# Altium schematic sheet GPS.SchDoc: GPS Module
size A; Date: 2025/09/10; Author: Ruo Chen; DrawnBy: Ruo Chen; Engineer: Ruo Chen; Revision: A; SheetNumber: 1; SheetTotal: 1
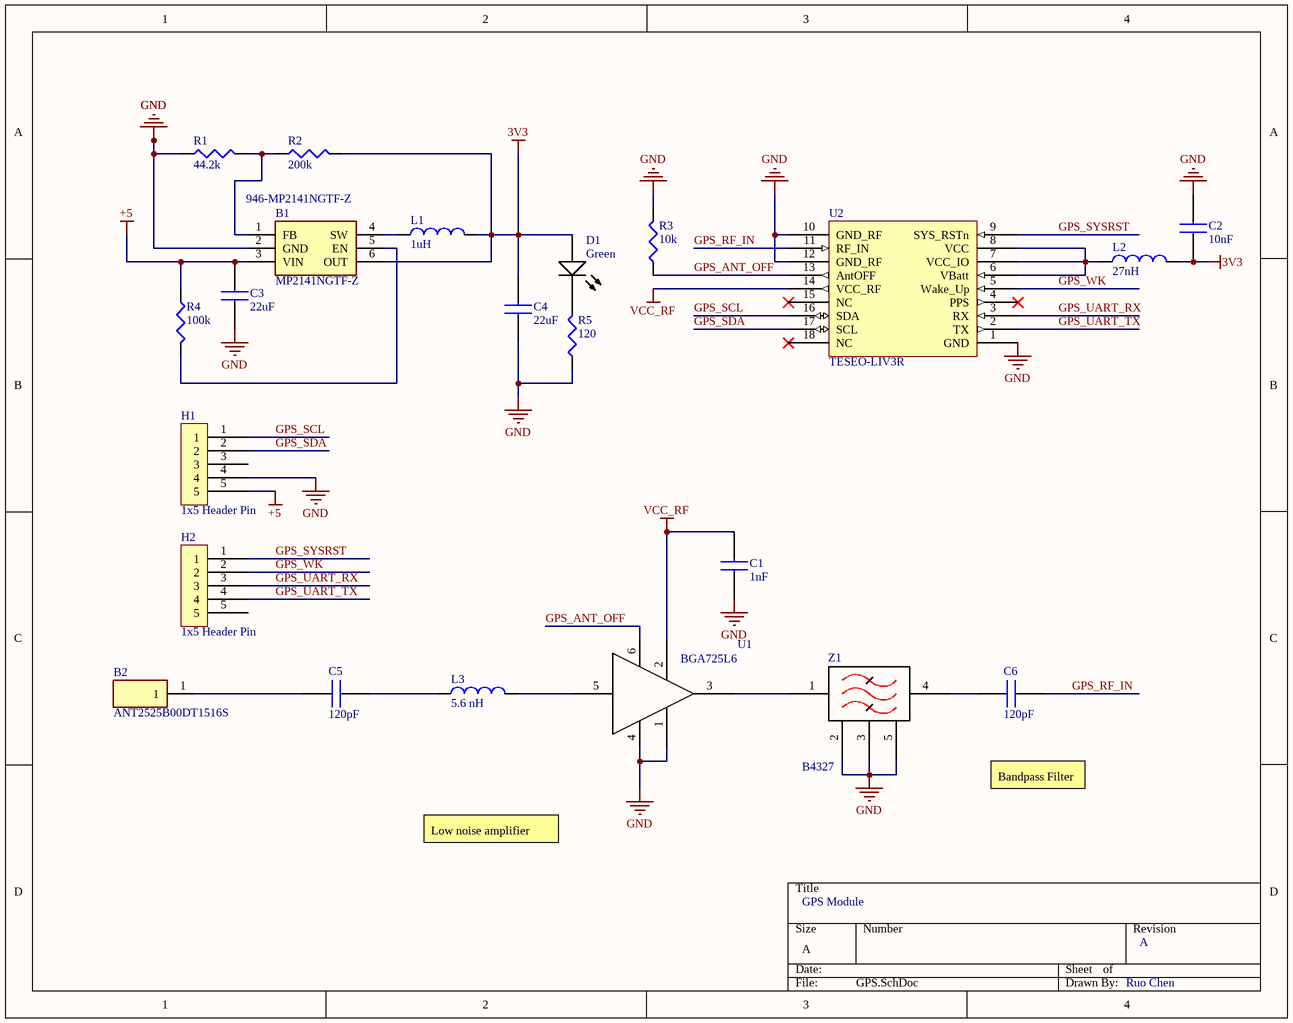
[diagram p0: GPS.SchDoc]

## Parts
B1  MP2141NGTF-Z  Supplier Part Number 1: 946-MP2141NGTF-Z  [MP2141NGTF-Z]
B2  ANT2525B00DT1516S  [ANT2525B00DT1516S]
C1  1nF  [CAP_1005M(0402)]
C2  10nF  [CAP_1005M(0402)]
C3  22uF  [CAP_3225M(1210)]
C4  22uF  [CAP_3225M(1210)]
C5  120pF  [CAP_1005M(0402)]
C6  120pF  [CAP_1005M(0402)]
D1  Green  [APG015CGKKC-TT]
H1  1x5 Header Pin  [M22-2510505]
H2  1x5 Header Pin  [M22-2510505]
L1  1uH  [IND_1008(2520m)]
L2  27nH  [IND_0402(1005m)]
L3  5.6 nH  [IND_(0805)]
R1  44.2k  [RES_YAG_0402]
R2  200k  [RES_YAG_0402]
R3  10k  [RES_YAG_0402]
R4  100k  [RES_YAG_0402]
R5  120  [RES_YAG_0402]
U1  BGA725L6  [BGA725L6E6327FTSA1]
U2  TESEO-LIV3R  [TESEOLIV3R]
Z1  B4327  [B39162B4327P810]

## Nets
3V3: B1.6(OUT) C2.2 C4.1 D1.2(A) L1.2 L2.2 R2.2
+5: B1.3(VIN) C3.1 H1.5 R4.1
GND: B1.2(GND) C1.2 C2.1 C3.2 C4.2 H1.4 R1.1 R3.2 R5.1 U1.1 U1.4 U2.1(GND) U2.10(GND_RF) U2.12(GND_RF) Z1.2 Z1.3 Z1.5
VCC_RF: C1.1 U1.2 U2.14(VCC_RF)
GPS_ANT_OFF: R3.1 U1.6 U2.13(AntOFF)
GPS_RF_IN: C6.1 U2.11(RF_IN)
GPS_SCL: H1.1 U2.16(SDA)
GPS_SDA: H1.2 U2.17(SCL)
GPS_SYSRST: H2.1 U2.9(SYS_RSTn)
GPS_UART_RX: H2.3 U2.3(RX)
GPS_UART_TX: H2.4 U2.2(TX)
GPS_WK: H2.2 U2.5(Wake_Up)
NetB1_1: B1.1(FB) R1.2 R2.1
NetB1_4: B1.4(SW) L1.1
NetB1_5: B1.5(EN) R4.2
NetB2_1: B2.1 C5.2
NetC5_1: C5.1 L3.1
NetC6_2: C6.2 Z1.4
NetD1_1: D1.1(K) R5.2
NetL2_1: L2.1 U2.6(VBatt) U2.7(VCC_IO) U2.8(VCC)
NetL3_2: L3.2 U1.5
NetU1_3: U1.3 Z1.1

Not connected (* = marked no-connect by the designer): H1 3; H2 5; U2 4(PPS)* 15(NC)* 18(NC)*

## Notes on the sheet
- Low noise amplifier
- Bandpass Filter

## Library data of the parts
B1 = MP2141NGTF-Z: IC REG 1A STEP-DOWN SYNCH 2.2MHz; Manufacturer_Name: Monolithic Power Systems (MPS); Geometry.Height: 0.6mm; Mouser Part Number: 946-MP2141NGTF-Z; Mouser Price/Stock: https://www.mouser.com/Search/Refine.aspx?Keyword=946-MP2141NGTF-Z; Manufacturer_Part_Number: MP2141NGTF-Z; Datasheet Link: https://componentsearchengine.com/Datasheets/1/MP2141NGTF-Z.pdf; Supplier 1: Mouser
B2 = ANT2525B00DT1516S: Antennas 20MHz 1575-1606MHz GPS & GLONASS; Manufacturer_Name: PULSE; Geometry.Height: 4.1mm; Mouser Part Number: 603-ANT225B00DT1516S; Mouser Price/Stock: https://www.mouser.co.uk/ProductDetail/Pulse-Electronics/ANT2525B00DT1516S?qs=oypCK0zG3250CICQYDti8w%3D%3D; Manufacturer_Part_Number: ANT2525B00DT1516S; Datasheet Link: https://productfinder.pulseelectronics.com/api/open/part-attachments/datasheet/ANT2525B00DT1516S; Supplier 1: Mouser; Supplier Part Number 1: 603-ANT225B00DT1516S
C1 = GCM155R71H102KA37: Chip Capacitor, 1nF +/-10%, 50V, 0402, Thickness 0.5 mm; Capacitor Type: Ceramic; Voltage Rating: 50; Case/Package: 0402; Max Operating Temperature: 125°C; Min Operating Temperature: -55°C; Mounting Technology: SM; Pins: 2; Ripple Current: *; Ripple Current (AC): *; RoHS Compliant: Yes; Tolerance: +/-10%; Value: 1nF; Supplier 1: Mouser; Supplier Part Number 1: 81-GCM155R71H102KA7J
C2 = GCM155R71H103KA55D: Chip Capacitor, 10nF +/-10%, 50V, 0402, Thickness 0.5 mm; Capacitor Type: Ceramic; Voltage Rating: 50; Case/Package: 0402; Max Operating Temperature: 125°C; Min Operating Temperature: -55°C; Mounting Technology: SM; Pins: 2; Ripple Current: *; Ripple Current (AC): *; RoHS Compliant: Yes; Tolerance: +/-10%; Value: 10nF; Supplier 1: Mouser; Supplier Part Number 1: 81-GCM155R71H103KA5D
C3 C4 = GCM32EC71E226KE36K: Chip Capacitor, 22uF +/-10%, 25V, 3225, Thickness 2.5 mm; Capacitor Type: Ceramic; Voltage Rating: 25; Case/Package: 3225; Max Operating Temperature: 125°C; Min Operating Temperature: -55°C; Mounting Technology: SM; Pins: 2; Ripple Current: *; Ripple Current (AC): *; RoHS Compliant: Yes; Tolerance: +/-10%; Value: 22uF; Supplier 1: Mouser; Supplier Part Number 1: 81-GCM32EC71E226KE6K
C5 C6 = GCM1555C1H121JA16: Chip Capacitor, 120pF +/-5%, 50V, 0402, Thickness 0.5 mm; Capacitor Type: Ceramic; Voltage Rating: 50; Case/Package: 0402; Max Operating Temperature: 125°C; Min Operating Temperature: -55°C; Mounting Technology: SM; Pins: 2; Ripple Current: *; Ripple Current (AC): *; RoHS Compliant: Yes; Tolerance: +/-5%; Value: 120pF; Supplier 1: Mouser; Supplier Part Number 1: 81-GCM1555C1H121JA6D
D1 = APG015CGKKC-TT: Green LED; Supplier 1: Mouser; Supplier Part Number 1: 604-APG015CGKKC-TT
H1 H2 = M22-2510505: 1x5, 3.5mm, 2 mm pitch; Supplier 1: Mouser; Supplier Part Number 1: 855-M22-2510505
L1 = 1239AS-H-1R0M=P2: 1uH, 20%, 1008(2520m), Inductor Shielded; Part Number: L08055R6CEWTR; Tolerance: 0.2 nH; Supplier 1: Mouser; Supplier Part Number 1: 81-1239AS-H-1R0MP2; Value: 1uH
L2 = LQG15HS27NJ02D: 27nH, 5%, 0402(1005m), Inductor Unshielded, 350ma; Part Number: L08055R6CEWTR; Tolerance: 0.2 nH; Value: 27nH; Supplier 1: Mouser; Supplier Part Number 1: 81-LQG15HS27NJ02D
L3 = L08055R6CESTR: 5.6(+/- 0.2) nH 0402 Inductor Unshielded; Part Number: L08055R6CEWTR; Tolerance: 0.2 nH; Value: 5.6 nH; Supplier 1: Mouser; Supplier Part Number 1: 581-L08055R6CESTR
R1 = RT0402FRE07200KL: 200k, 0402(1005m), 01(03m)h, 1%, 50V, -55-155 C, 1/16W; Value: 44.2k; Supplier 1: Mouser; Supplier Part Number 1: 603-RT0402FRE07200KL
R2 = RT0402FRE0744K2L: 44.2k, 0402(1005m), 01(03m)h, 1%, 50V, -55-155 C, 1/16W; Value: 200k; Supplier 1: Mouser; Supplier Part Number 1: 603-RT0402FRE07200KL
R3 = RT0402FRE0710KL: 10k, 0402(1005m), 01(03m)h, 1%, 50V, -55-155 C, 1/16W; Value: 10k; Supplier 1: Mouser; Supplier Part Number 1: 603-RT0402FRE0710KL
R4 = RT0402FRE07100KL: 100k, 0402(1005m), 01(03m)h, 1%, 50V, -55-155 C, 1/16W; Value: 100k; Supplier 1: Mouser; Supplier Part Number 1: 603-RT0402FRE07100KL
R5 = RT0402FRE07120RL: 120, 0402(1005m), 01(03m)h, 1%, 50V, -55-155 C, 1/16W; Value: 120; Supplier 1: Mouser; Supplier Part Number 1: 603-RT0402FRE07120RL
U1 = BGA725L6: RF Amplifier RF SILICON MMIC 1.55 GHz to 1.615 GHz 1.5 V to 3.6 V 3.6 mA 20 dB; Supplier 1: Avnet; Supplier 2: Mouser; Supplier Part Number 1: BGA725L6E6327FTSA1; Supplier Part Number 2: 726-BGA725L6E6327
U2 = TESEO-LIV3R: GNSS / GPS Modules Teseo ROM GNSS module; Supplier 1: Mouser; Supplier Part Number 1: 511-TESEO-LIV3R
Z1 = B39162B4327P810: Supplier 1: Mouser; Supplier Part Number 1: 871-B39162B4327P810